# Altium schematic sheet MICROCONTROLLER.SchDoc
size 420 x 297 mm; SheetNumber: 2; SheetTotal: 3
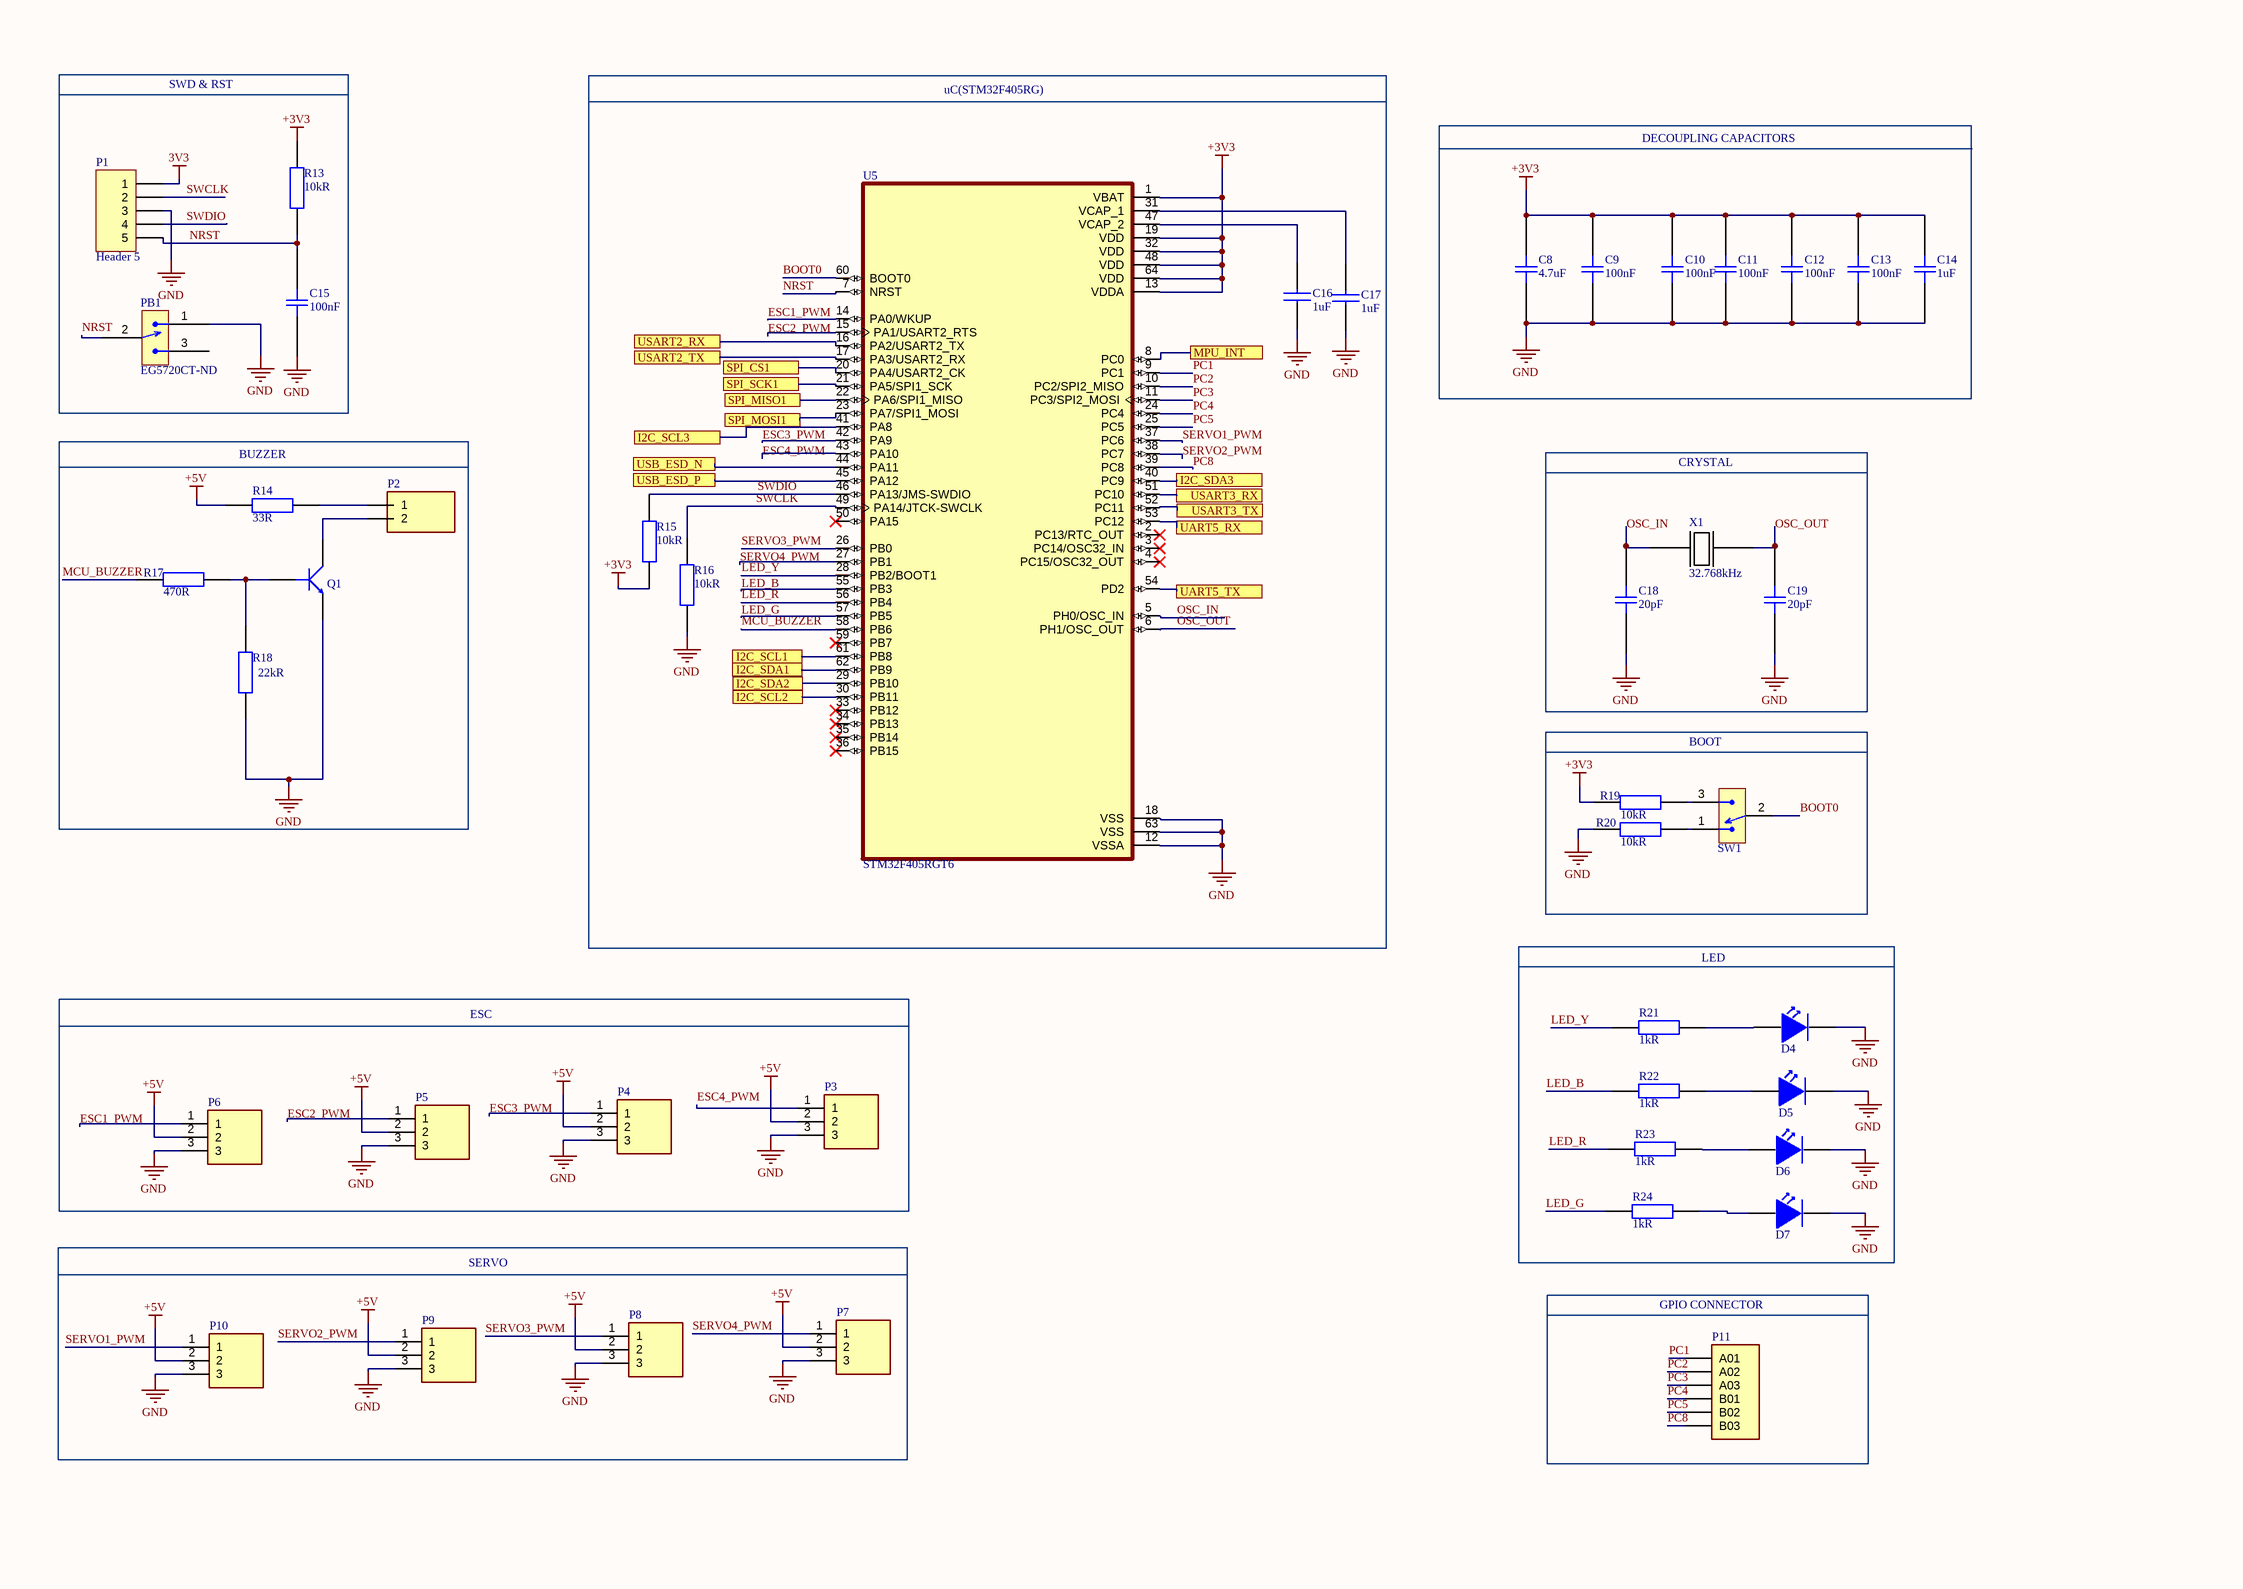
[diagram p0: MICROCONTROLLER.SchDoc]

## Parts
C8  Capacitance: 4.7uF  [CAP_0805]  (hidden comment: CL21A475KAQNNNE)
C9  Capacitance: 100nF  [CAP_0603]  (hidden comment: CAP CER 100nF 0603)
C10  Capacitance: 100nF  [CAP_0603]  (hidden comment: CAP CER 100nF 0603)
C11  Capacitance: 100nF  [CAP_0603]  (hidden comment: CAP CER 100nF 0603)
C12  Capacitance: 100nF  [CAP_0603]  (hidden comment: CAP CER 100nF 0603)
C13  Capacitance: 100nF  [CAP_0603]  (hidden comment: CAP CER 100nF 0603)
C14  Capacitance: 1uF  [CAP_0805]  (hidden comment: CAP_CER_1uF 0805)
C15  Capacitance: 100nF  [CAP_0603]  (hidden comment: CAP CER 100nF 0603)
C16  Capacitance: 1uF  [CAP_0805]  (hidden comment: CL21B105KBFNNNE)
C17  Capacitance: 1uF  [CAP_0805]  (hidden comment: CL21B105KBFNNNE)
C18  Parameter 1: 20pF  [CAP_0603]  (hidden comment: CAP_CER_20pF)
C19  Parameter 1: 20pF  [CAP_0603]  (hidden comment: CAP_CER_20pF)
D4  LED_GREEN_0805  [LED_GREEN_0805]  (value not drawn)
D5  LED_GREEN_0805  [LED_GREEN_0805]  (value not drawn)
D6  LED_GREEN_0805  [LED_GREEN_0805]  (value not drawn)
D7  LED_GREEN_0805  [LED_GREEN_0805]  (value not drawn)
P1  Header 5  [HDR1X5]
P2  Connector Header Through Hole  [S2B-XH-A]  (value not drawn)
P3  Header 3 pin  [5-146281-3 header]  (value not drawn)
P4  Header 3 pin  [5-146281-3 header]  (value not drawn)
P5  Header 3 pin  [5-146281-3 header]  (value not drawn)
P6  Header 3 pin  [5-146281-3 header]  (value not drawn)
P7  Header 3 pin  [5-146281-3 header]  (value not drawn)
P8  Header 3 pin  [5-146281-3 header]  (value not drawn)
P9  Header 3 pin  [5-146281-3 header]  (value not drawn)
P10  Header 3 pin  [5-146281-3 header]  (value not drawn)
P11  Connector 2x3 SMD  [AMPHENOL]  (value not drawn)
PB1  Supplier Part Number 1: EG5720CT-ND  [EG1215AA]  (hidden comment: EG1215AA)
Q1  BC817  [SOT95P23]  (value not drawn)
R13  Resistance: 10kR  [RES_0603]  (hidden comment: RC0603FR-0710KL)
R14  Resistance: 33R  [RES_0603]  (hidden comment: RC0603JR-0715RL)
R15  Resistance: 10kR  [RES_0603]  (hidden comment: RC0603FR-0710KL)
R16  Resistance: 10kR  [RES_0603]  (hidden comment: RC0603FR-0710KL)
R17  Resistance: 470R  [RES_0603]  (hidden comment: RC0603FR-0710KL)
R18  Resistance: 22kR  [RES_0603]  (hidden comment: RC0603FR-0710KL)
R19  Resistance: 10kR  [RES_0603]  (hidden comment: RC0603FR-0710KL)
R20  Resistance: 10kR  [RES_0603]  (hidden comment: RC0603FR-0710KL)
R21  Resistance: 1kR  [RES_0603]  (hidden comment: RC0603FR-0710KL)
R22  Resistance: 1kR  [RES_0603]  (hidden comment: RC0603FR-0710KL)
R23  Resistance: 1kR  [RES_0603]  (hidden comment: RC0603FR-0710KL)
R24  Resistance: 1kR  [RES_0603]  (hidden comment: RC0603FR-0710KL)
SW1  EG1215AA  [EG1215AA]  (value not drawn)
U5  STM32F405RGT6  [QFP50P_STM32]
X1  Frequency: 32.768kHz  [ABS05-32.768KHZ-T]  (hidden comment: CRYSTAL 32.768kHz)

## Blocks framed on the sheet
SWD & RST: C15 P1 PB1 R13
uC(STM32F405RG): C16 C17 R15 R16 U5
DECOUPLING CAPACITORS: C8-C14
BUZZER: P2 Q1 R14 R17 R18
CRYSTAL: C18 C19 X1
BOOT: R19 R20 SW1
LED: D4-D7 R21-R24
ESC: P3-P6
SERVO: P7-P10
GPIO CONNECTOR: P11

## Ports
I2C_SCL1 (see MODULES[2A]), I2C_SCL2 (see MODULES[4A]), I2C_SCL3 (see MODULES[5D]), I2C_SDA1 (see MODULES[2A]), I2C_SDA2 (see MODULES[4A]), I2C_SDA3 (see MODULES[5D]), MPU_INT (see MODULES[3A]), SPI_CS1 (see MODULES[1C]), SPI_MISO1 (see MODULES[2C]), SPI_MOSI1 (see MODULES[1C]), SPI_SCK1 (see MODULES[1C]), UART5_RX (see MODULES[4D]), UART5_TX (see MODULES[4D]), USART2_RX (see MODULES[4C]), USART2_TX (see MODULES[4C]), USART3_RX (see MODULES[5C]), USART3_TX (see MODULES[5C]), USB_ESD_N (see POWER[5A]), USB_ESD_P (see POWER[5A])

## Nets
3V3: P1.1
+3V3: C8.2 C9.2 C10.2 C11.2 C12.2 C13.2 C14.2 R13.2 R15.1 R19.1 U5.1(VBAT) U5.13(VDDA) U5.19(VDD) U5.32(VDD) U5.48(VDD) U5.64(VDD)
+5V: P3.2 P4.2 P5.2 P6.2 P7.2 P8.2 P9.2 P10.2 R14.1
GND: C8.1 C9.1 C10.1 C11.1 C12.1 C13.1 C14.1 C15.1 C16.1 C17.1 C18.1 C19.1 D4.1 D5.1 D6.1 D7.1 P1.3 P3.3 P4.3 P5.3 P6.3 P7.3 P8.3 P9.3 P10.3 PB1.1 Q1.2 R16.1 R18.1 R20.1 U5.12(VSSA) U5.18(VSS) U5.63(VSS)
BOOT0: SW1.2 U5.60(BOOT0)
ESC1_PWM: P6.1 U5.14(PA0/WKUP)
ESC2_PWM: P5.1 U5.15(PA1/USART2_RTS)
ESC3_PWM: P4.1 U5.42(PA9)
ESC4_PWM: P3.1 U5.43(PA10)
I2C_SCL1: U5.61(PB8) ; port I2C_SCL1
I2C_SCL2: U5.30(PB11) ; port I2C_SCL2
I2C_SCL3: U5.41(PA8) ; port I2C_SCL3
I2C_SDA1: U5.62(PB9) ; port I2C_SDA1
I2C_SDA2: U5.29(PB10) ; port I2C_SDA2
I2C_SDA3: U5.40(PC9) ; port I2C_SDA3
LED_B: R22.1 U5.55(PB3)
LED_G: R24.1 U5.57(PB5)
LED_R: R23.1 U5.56(PB4)
LED_Y: R21.1 U5.28(PB2/BOOT1)
MCU_BUZZER: R17.1 U5.58(PB6)
MPU_INT: U5.8(PC0) ; port MPU_INT
NRST: C15.2 P1.5 PB1.2 R13.1 U5.7(NRST)
OSC_IN: C18.2 U5.5(PH0/OSC_IN) X1.1
OSC_OUT: C19.2 U5.6(PH1/OSC_OUT) X1.2
PC1: P11.A01 U5.9(PC1)
PC2: P11.A02 U5.10(PC2/SPI2_MISO)
PC3: P11.A03 U5.11(PC3/SPI2_MOSI)
PC4: P11.B01 U5.24(PC4)
PC5: P11.B02 U5.25(PC5)
PC8: P11.B03 U5.39(PC8)
SERVO1_PWM: P10.1 U5.37(PC6)
SERVO2_PWM: P9.1 U5.38(PC7)
SERVO3_PWM: P8.1 U5.26(PB0)
SERVO4_PWM: P7.1 U5.27(PB1)
SPI_CS1: U5.20(PA4/USART2_CK) ; port SPI_CS1
SPI_MISO1: U5.22(PA6/SPI1_MISO) ; port SPI_MISO1
SPI_MOSI1: U5.23(PA7/SPI1_MOSI) ; port SPI_MOSI1
SPI_SCK1: U5.21(PA5/SPI1_SCK) ; port SPI_SCK1
SWCLK: P1.2 R16.2 U5.49(PA14/JTCK-SWCLK)
SWDIO: P1.4 R15.2 U5.46(PA13/JMS-SWDIO)
UART5_RX: U5.53(PC12) ; port UART5_RX
UART5_TX: U5.54(PD2) ; port UART5_TX
USART2_RX: U5.16(PA2/USART2_TX) ; port USART2_RX
USART2_TX: U5.17(PA3/USART2_RX) ; port USART2_TX
USART3_RX: U5.51(PC10) ; port USART3_RX
USART3_TX: U5.52(PC11) ; port USART3_TX
USB_ESD_N: U5.44(PA11) ; port USB_ESD_N
USB_ESD_P: U5.45(PA12) ; port USB_ESD_P
NetC16_2: C16.2 U5.47(VCAP_2)
NetC17_2: C17.2 U5.31(VCAP_1)
NetD4_2: D4.2 R21.2
NetD5_2: D5.2 R22.2
NetD6_2: D6.2 R23.2
NetD7_2: D7.2 R24.2
NetP2_1: P2.1 R14.2
NetP2_2: P2.2 Q1.3
NetQ1_1: Q1.1 R17.2 R18.2
NetR19_2: R19.2 SW1.3
NetR20_2: R20.2 SW1.1

Not connected (* = marked no-connect by the designer): PB1 3; U5 2(PC13/RTC_OUT)* 3(PC14/OSC32_IN)* 4(PC15/OSC32_OUT)* 33(PB12)* 34(PB13)* 35(PB14)* 36(PB15)* 50(PA15)* 59(PB7)*

## Notes on the sheet
- THIS DOCUMENT AND THE DATA DISCLOSED HEREIN OR
- HEREWITH IS THE PROPERTY OF ALTIUM LIMITED AND MAY
- DWG NO:
- REVISION
- REV:
- DESCRIPTION
- DATE
- APPROVED
- BE FREELY DISTRIBUTED IN WHOLE. NO RIGHTS ARE
- RESERVED OR EXPRESS OR IMPLIED WARANTEE GIVEN.
- ENG:
- APPROVALS
- PROJECT
- DSN:
- CHK:
- REFERENCE DOCUMENTS
- PROJECT REVISION:
- TITLE
- DOCUMENT REVISION:
- DESIGN ITEM:
- BOM:
- FAB DWG:
- PCB DWG:
- ASSY DWG:
- SCALE:
- A3
- SIZE
- CAGE CODE
- FILE NAME
- DWG NO.
- SHEET
- OF
- REV

## Library data of the parts
C8 = CAP CER 4.7uF 0805: Multilayer Ceramic Capacitor, 4.7 uF, 25 V, ± 10%, X5R, 0805 [2012 Metric]; Manufacturer: Samsung; Voltage Rating: 25V; Supplier 1: Digikey; Manufacturer Part Number: CL21A475KAQNNNE; RoHS: Yes; Category: Ceramic Capacitors; Stock 1: 3190611; Pricing 1: 1=0,1, 10=0,069, 50=0,0414, 100=0,0326, 500=0,02408, 1000=0,01994 (USD); Mount: Surface Mount; Case/Package: 0805; Case Code (Metric): 2012; Case Code (Imperial): 0805; Material: Ceramic; Min Operating Temperature: -55°C; Max Operating Temperature: 85°C; Packaging: Tape and Reel; Tolerance: 10%; Dielectric: X5R; Voltage Rating (DC): 25V; Series: CL; Construction: Flat; Length: 2mm; Height: 1.25mm; Depth: 1.25mm; Radiation Hardening: No; Lead Free: Lead Free; RoHS Compliant: Yes; ComponentLink1URL: https://datasheet.ciiva.com/25798/cl21a475kaqnnne-25798882.pdf?src-supplier=Digikey; ComponentLink1Description: https://datasheet.ciiva.com/25798/cl21a475kaqnnne-25798882.pdf?src-supplier=Digikey; Supplier Part Number 1: 1276-1244-1-ND
C9-C13 C15 = CAP CER 100nF 0603: Multilayer Ceramic Capacitor, 0.1 uF, 50 V, ± 10%, X7R, 0603 [1608 Metric]; Manufacturer: KEMET; Manufacturer Part Number: C0603C104K5RACTU; Material: 4241ConductorMaterial; Voltage Rating: 50V; Temperature Coefficient: 30ppm/°C; Supplier 1: Digikey; RoHS: Yes; Category: Ceramic Capacitors; Stock 1: 4814912; Pricing 1: 1=0,11, 10=0,074, 50=0,0424, 100=0,0329, 500=0,02474, 1000=0,01944 (USD); Mount: Surface Mount; Case/Package: 0603; Min Operating Temperature: -55°C; Max Operating Temperature: 125°C; Tolerance: 10%; Packaging: Tape and Reel; Dielectric: X7R; Voltage: 50V; Series: SMD Comm X7R; Length: 0.063inch; Width: 0.031inch; Thickness: 0.034inch; RoHS Compliant: Yes; Lead Free: 5697LeadFree; Supplier Part Number 1: 399-C0603C104K5RAC7867DKR-ND
C14 = CAP_CER_1uF 0805: Multilayer Ceramic Capacitor, 1 uF, 25 V, ± 10%, X7R, 0805 [2012 Metric]; Manufacturer: Kyocera AVX; Manufacturer Part Number: 08053C105K4T2A; Material: 4241ConductorMaterial; Voltage Rating: 25V; Dissipation Factor: 12.5%; Insulation Resistance: 100GR; Supplier 1: Digikey; RoHS: Yes; Category: Ceramic Capacitors; Stock 1: 50944; Pricing 1: 1=0,32, 10=0,207, 50=0,145, 100=0,1171, 500=0,08702, 1000=0,07614 (USD); Mount: Surface Mount; Case/Package: 0805; Case Code (Imperial): 0805; Case Code (Metric): 2012; Min Operating Temperature: -55°C; Max Operating Temperature: 125°C; Tolerance: 10%; Packaging: Tape and Reel; Dielectric: X7R; Series: -; Voltage Rating (DC): 25V; Package Quantity: 1; Termination: SMD/SMT; Construction: Flat; Length: 2.01mm; Width: 0.049inch; Height: 1.4mm; Thickness: 0.037inch; Depth: 1.25mm; Ratings: AEC-Q200; Radiation Hardening: No; RoHS Compliant: Yes; Lead Free: Lead Free; Reach SVHC Compliant: No; ComponentLink1URL: https://datasheet.ciiva.com/11499/cauto-11499837.pdf?src-supplier=Avnet; ComponentLink1Description: https://datasheet.ciiva.com/11499/cauto-11499837.pdf?src-supplier=Avnet; ComponentLink2URL: https://datasheet.ciiva.com/22682/1679506-22682869.pdf?src-supplier=Element14; ComponentLink2Description: https://datasheet.ciiva.com/22682/1679506-22682869.pdf?src-supplier=Element14; ComponentLink3URL: https://datasheet.ciiva.com/28586/1679506-28586101.pdf?src-supplier=Element14; ComponentLink3Description: https://datasheet.ciiva.com/28586/1679506-28586101.pdf?src-supplier=Element14; ComponentLink4URL: https://datasheet.ciiva.com/28586/1679506-28586778.pdf?src-supplier=Element14; ComponentLink4Description: https://datasheet.ciiva.com/28586/1679506-28586778.pdf?src-supplier=Element14; ComponentLink5URL: https://datasheet.ciiva.com/154/cauto-154795.pdf?src-supplier=Digikey; ComponentLink5Description: https://datasheet.ciiva.com/154/cauto-154795.pdf?src-supplier=Digikey; ComponentLink6URL: https://datasheet.ciiva.com/154/cauto-154794.pdf?src-supplier=Digikey; ComponentLink6Description: https://datasheet.ciiva.com/154/cauto-154794.pdf?src-supplier=Digikey; ComponentLink7URL: https://datasheet.ciiva.com/154/cauto-154796.pdf?src-supplier=Digikey; ComponentLink7Description: https://datasheet.ciiva.com/154/cauto-154796.pdf?src-supplier=Digikey; ComponentLink8URL: https://datasheet.ciiva.com/5412/cauto-5412822.pdf?src-supplier=Mouser; ComponentLink8Description: https://datasheet.ciiva.com/5412/cauto-5412822.pdf?src-supplier=Mouser; Supplier Part Number 1: 478-KAM21KR71E105KUCT-ND
C16 C17 = CAP CER 1uF 0805: CAP CER 1uF %10 0805; Manufacturer: Samsung; Designed by: BERK; Tolerance: 10%; Voltage Rating: 50V; Dielectric: X7R; Supplier 1: Digi-Key; Manufacturer Part Number: CL21B105KBFNNNE; RoHS: Yes; Category: Ceramic Capacitors; Stock 1: 958000; Pricing 1: 2000=0,02138, 4000=0,01956 (USD); Mount: Surface Mount; Case/Package: 0805; Case Code (Metric): 2012; Case Code (Imperial): 0805; Min Operating Temperature: -55°C; Max Operating Temperature: 125°C; Packaging: Tape and Reel; Package Quantity: 1; Voltage: 50V; Series: CL; Construction: Flat; Length: 2mm; Width: 0.049inch; Height: 1.25mm; Thickness: 0.053inch; Depth: 1.25mm; Radiation Hardening: No; RoHS Compliant: Yes; ComponentLink1URL: https://datasheet.ciiva.com/25800/cl21b105kbfnnne-25800291.pdf?src-supplier=Digi-Key; ComponentLink1Description: https://datasheet.ciiva.com/25800/cl21b105kbfnnne-25800291.pdf?src-supplier=Digi-Key; ComponentLink2URL: https://datasheet.ciiva.com/16449/cl21b105kbfnnne-16449003.pdf?src-supplier=Future+Electronics; ComponentLink2Description: https://datasheet.ciiva.com/16449/cl21b105kbfnnne-16449003.pdf?src-supplier=Future+Electronics; ComponentLink3URL: https://datasheet.ciiva.com/26838/getdatasheetpartid-354075-26838668.pdf?src-supplier=Verical; ComponentLink3Description: https://datasheet.ciiva.com/26838/getdatasheetpartid-354075-26838668.pdf?src-supplier=Verical; Supplier Part Number 1: 1276-1029-2-ND
C18 C19 = CAP_CER_20pF: Multilayer Ceramic Capacitor, 20 pF, 50 V, ± 5%, C0G (NP0), 0603 [1608 Metric]; Manufacturer: Samsung; Manufacturer Part Number: CL10C200JB8NNNC; Voltage Rating (DC): 50V; Supplier 1: Digikey; RoHS: Yes; Category: Ceramic Capacitors; Stock 1: 288914; Pricing 1: 1=0,1, 10=0,041, 50=0,0238, 100=0,0184, 500=0,01386, 1000=0,01089 (USD); ComponentLink1URL: https://datasheet.ciiva.com/26877/getdatasheetpartid-640634-26877974.pdf?src-supplier=Verical; ComponentLink1Description: https://datasheet.ciiva.com/26877/getdatasheetpartid-640634-26877974.pdf?src-supplier=Verical; ComponentLink2URL: https://datasheet.ciiva.com/26310/mlcc-catalogdownload2013-eng-26310315.pdf?src-supplier=Distrelec; ComponentLink2Description: https://datasheet.ciiva.com/26310/mlcc-catalogdownload2013-eng-26310315.pdf?src-supplier=Distrelec; Supplier Part Number 1: 1276-1187-1-ND
D4-D7 = LED_GREEN_0805: LED Low-Power Uni-Color Green 565nm 2.1V 2-Pin Chip LED T/R; Manufacturer: Vishay Lite-On; Manufacturer Part Number: LTST-C171GKT; Lens Color: Colorless; Viewing Angle: 130°; Lens Style: Flat,Diffused,Colorless,Rectangular,Clear; Luminous Intensity: 12mcd; Forward Current: 30mA; Power Rating: 100mW; Dominant Wavelength: 569nm; Test Current: 10mA; Lens Transparency: Clear; Number of Elements: 1; Reverse Voltage: 5V; Lens Size: 1.25mm; Supplier 1: Digikey; RoHS: Yes; Category: LEDs; Stock 1: 370169; Pricing 1: 1=0,26, 10=0,143, 100=0,0663, 500=0,0612, 1000=0,04794 (USD); Mount: Surface Mount; Case/Package: 0805; Number of Pins: 2; Color: Green; Case Code (Metric): 2012; Case Code (Imperial): 0805; Min Operating Temperature: -55°C; Max Operating Temperature: 85°C; Package Quantity: 3000; Packaging: Tape and Reel; Forward Voltage: 2.1V; Illumination Color: Green; Power Dissipation: 100mW; Wavelength: 565nm; Number of LEDs: 1; Series: -; Length: 2mm; Width: 1.25mm; Height: 0.9mm; Depth: 1.25mm; Radiation Hardening: No; Lead Free: Lead Free; RoHS Compliant: Yes; ComponentLink1URL: https://datasheet.ciiva.com/2110/ltst-c171gkt-2110000.pdf?src-supplier=Digikey; ComponentLink1Description: https://datasheet.ciiva.com/2110/ltst-c171gkt-2110000.pdf?src-supplier=Digikey; ComponentLink2URL: https://datasheet.ciiva.com/11773/0900766b80dc0296-11773991.pdf?src-supplier=Rs; ComponentLink2Description: https://datasheet.ciiva.com/11773/0900766b80dc0296-11773991.pdf?src-supplier=Rs; ComponentLink3URL: https://datasheet.ciiva.com/12400/lite-on-ltst-c171gkt-190133-12400647.pdf?src-supplier=Mouser; ComponentLink3Description: https://datasheet.ciiva.com/12400/lite-on-ltst-c171gkt-190133-12400647.pdf?src-supplier=Mouser; ComponentLink4URL: https://datasheet.ciiva.com/2110/ltst-c171gkt-2110001.pdf?src-supplier=Digikey; ComponentLink4Description: https://datasheet.ciiva.com/2110/ltst-c171gkt-2110001.pdf?src-supplier=Digikey; ComponentLink5URL: https://datasheet.ciiva.com/2110/ltst-c171gkt-2110002.pdf?src-supplier=Digikey; ComponentLink5Description: https://datasheet.ciiva.com/2110/ltst-c171gkt-2110002.pdf?src-supplier=Digikey; ComponentLink6URL: https://datasheet.ciiva.com/16396/ltst-c171gkt-16396549.pdf?src-supplier=Future+Electronics; ComponentLink6Description: https://datasheet.ciiva.com/16396/ltst-c171gkt-16396549.pdf?src-supplier=Future+Electronics; Supplier Part Number 1: 160-1423-6-ND
P1 = Header 5: Header, 5-Pin; LatestRevisionDate: 17-Jul-2002; LatestRevisionNote: Re-released for DXP Platform.; Publisher: Altium Limited
P3-P10 = Header 3 pin: CONN HEADER VERT 3POS 2.54MM / Connector Header Through Hole 3 position 0.100" (2.54mm); Manufacturer: TE Connectivity; Manufacturer Part Number: 5-146281-3; Manufacturer Lifecycle Status: ACTIVE; Approvals: CSA; Connector Type: Header, Pin, Plug; Contact Current Rating: 3A; Gender: Male; High Speed Serial Data Connector: No; High Temperature Housing: Yes; Insulation Resistance: 5GΩ; Lead Length: 3.048mm; Mating Post Length: 5.842mm; Number of Contacts: 3; Number of Ports: 1; PCB Mounting Orientation: Vertical; PCB Thickness: 1.6002mm; Plating Thickness: 762nm; Shielding: Unshielded; Supplier 1: Farnell; RoHS: Compliant; Category: Headers and Wire Housings; Stock 1: 263; Pricing 1: 10=0,602, 50=0,55, 100=0,462, 250=0,419 (EUR); China RoHS: Compliant; Color: Black; Contact Gender: Male; Contact Mating Length: 5.842mm; Contact Plating: Gold; Contact Shape: Square; Contact Style: Pin; Current Rating: 3A; Depth: 2.34mm; Export Control Classification Number (ECCN) Code: EAR99; ELV: Compliant; Flammability Rating: UL94 V-0; Housing Color: Black; Housing Material: Polymer; Harmonized Tariff Schedule (HTS) Code: 8536.69.40.40; Insulation Color: Black; Introduction Date: 2005-06-13; Keyed: No; Lead Free: Lead Free; Length: 7.21mm; Lifecycle Status: Production; Max Operating Temperature: 105°C; Min Operating Temperature: -65°C; Mount: Through Hole; Number of Pins: 3; Number of Positions: 3; Number of Rows: 1; Orientation: Vertical; Packaging: Carton; Pitch: 2.54mm; Radiation Hardening: No; Ratings: CSA; REACH SVHC: Yes; Row Spacing: 2.54mm; Terminal Pitch: 2.54mm; Termination: Solder; ComponentLink1URL: https://datasheet.octopart.com:443/5-146281-3-TE-Connectivity-datasheet-180097156.pdf?src-supplier=JRH+Electronics; ComponentLink1Description: https://datasheet.octopart.com:443/5-146281-3-TE-Connectivity-datasheet-180097156.pdf?src-supplier=JRH+Electronics; ComponentLink2URL: https://datasheet.octopart.com:443/5-146281-3-TE-Connectivity-datasheet-181434920.pdf?src-supplier=JRH+Electronics; ComponentLink2Description: https://datasheet.octopart.com:443/5-146281-3-TE-Connectivity-datasheet-181434920.pdf?src-supplier=JRH+Electronics; ComponentLink3URL: https://datasheet.octopart.com:443/5-146281-3-TE-Connectivity-datasheet-11894384.pdf?src-supplier=Electro+Sonic; ComponentLink3Description: https://datasheet.octopart.com:443/5-146281-3-TE-Connectivity-datasheet-11894384.pdf?src-supplier=Electro+Sonic; ComponentLink4URL: https://sigma.octopart.com:443/136685837/technical_drawing/TE-Connectivity-5-146281-3.pdf?src-supplier=Sager+Electronics; ComponentLink4Description: https://sigma.octopart.com:443/136685837/technical_drawing/TE-Connectivity-5-146281-3.pdf?src-supplier=Sager+Electronics; ComponentLink5URL: https://sigma.octopart.com:443/77883388/technical_drawing/TE-Connectivity-5-146281-3.pdf?src-supplier=TE+Connectivity; ComponentLink5Description: https://sigma.octopart.com:443/77883388/technical_drawing/TE-Connectivity-5-146281-3.pdf?src-supplier=TE+Connectivity; ComponentLink6URL: https://datasheet.octopart.com:443/5-146281-3-AMP-datasheet-176948369.pdf?src-supplier=Burklin+Elektronik; ComponentLink6Description: https://datasheet.octopart.com:443/5-146281-3-AMP-datasheet-176948369.pdf?src-supplier=Burklin+Elektronik; ComponentLink7URL: https://datasheet.octopart.com:443/5-146281-3-TE-Connectivity-datasheet-62113853.pdf?src-supplier=RS+(Formerly+Allied+Electronics); ComponentLink7Description: https://datasheet.octopart.com:443/5-146281-3-TE-Connectivity-datasheet-62113853.pdf?src-supplier=RS+(Formerly+Allied+Electronics); ComponentLink8URL: https://datasheet.octopart.com:443/5-146281-3-TE-Connectivity-datasheet-20738154.pdf?src-supplier=RS+(Formerly+Allied+Electronics); ComponentLink8Description: https://datasheet.octopart.com:443/5-146281-3-TE-Connectivity-datasheet-20738154.pdf?src-supplier=RS+(Formerly+Allied+Electronics); ComponentLink9URL: https://datasheet.octopart.com:443/5-146281-3-Tyco-Electronics-datasheet-9871387.pdf?src-supplier=RS+(Formerly+Allied+Electronics); ComponentLink9Description: https://datasheet.octopart.com:443/5-146281-3-Tyco-Electronics-datasheet-9871387.pdf?src-supplier=RS+(Formerly+Allied+Electronics); ComponentLink10URL: http://sigma.octopart.com:80/38847167/materials_sheet/TE-Connectivity-5-146281-3.pdf?src-supplier=Compliance+Statements; ComponentLink10Description: http://sigma.octopart.com:80/38847167/materials_sheet/TE-Connectivity-5-146281-3.pdf?src-supplier=Compliance+Statements; ComponentLink11URL: http://sigma.octopart.com:80/78323269/materials_sheet/TE-Connectivity-5-146281-3.pdf?src-supplier=Compliance+Statements; ComponentLink11Description: http://sigma.octopart.com:80/78323269/materials_sheet/TE-Connectivity-5-146281-3.pdf?src-supplier=Compliance+Statements; ComponentLink12URL: http://sigma.octopart.com:80/136743184/materials_sheet/TE-Connectivity-5-146281-3.pdf?src-supplier=Compliance+Statements; ComponentLink12Description: http://sigma.octopart.com:80/136743184/materials_sheet/TE-Connectivity-5-146281-3.pdf?src-supplier=Compliance+Statements; ComponentLink13URL: http://sigma.octopart.com:80/14915290/rohs_certificate/Agastat-5-146281-3.pdf?src-supplier=Compliance+Statements; ComponentLink13Description: http://sigma.octopart.com:80/14915290/rohs_certificate/Agastat-5-146281-3.pdf?src-supplier=Compliance+Statements; Supplier Part Number 1: 5-146281-3
P11 = Connector 2x3 SMD: 6pin 2.54mm 2 2.54mm Header，Push-Pull 3A 2.54μm tin SMD mount 7.78mm(Length)*7.37mm(height); Manufacturer: Amphenol Communications Solutions; Manufacturer Part Number: 10125394-T0803ALF; Dielectric Material: Polyethylene; Gender: Male; Insulation Resistance: 5GΩ; Number of Positions: 6; Row Spacing: 5.46mm; Supplier 1: Mouser; RoHS: Compliant; Category: Card Edge Connectors; Stock 1: 1906; Pricing 1: 1=0,55, 10=0,47, 50=0,47, 100=0,383, 1000=0,325, 10000=0,305 (USD); Current Rating: 3A; Insulation Color: Black; Lifecycle Status: Production; Max Operating Temperature: 125°C; Min Operating Temperature: -65°C; Number of Rows: 2; Orientation: Straight; Pitch: 2.54mm; Plating Thickness: 2.54µm; REACH SVHC: Yes; Terminal Pitch: 2.54mm; ComponentLink1URL: https://datasheet.octopart.com:443/10125394-T0803ALF-Amphenol-Communications-Solutions-datasheet-182239538.pdf?src-supplier=IHS; ComponentLink1Description: https://datasheet.octopart.com:443/10125394-T0803ALF-Amphenol-Communications-Solutions-datasheet-182239538.pdf?src-supplier=IHS; Supplier Part Number 1: 649-10125394T0803ALF
PB1 = EG1215AA: Slide Switch, SPDT, 0.025A, 24V, SMD; Manufacturer: E-Switch; Mechanical Life: 10000Cycles; Switch Function: On-On; Actuator Type: Standard; Switch Travel: 1.5mm; Operating Force: 150gf; Actuator Length: 1.4mm; Supplier 1: Digikey; Manufacturer Part Number: EG1215AA; RoHS: Yes; Stock 1: 15837; Pricing 1: 1=0,99, 10=0,951, 25=0,8884, 100=0,7715, 250=0,702, 500=0,6508, 1000=0,60327 (USD); Mount: Surface Mount; Min Operating Temperature: -20°C; Max Operating Temperature: 70°C; Throw Configuration: SPDT; Packaging: Cut Tape; Voltage Rating (DC): 24V; Termination: Gull Wing; Electrical Life: 10000Cycles; Series: EG; RoHS Compliant: Yes; ComponentLink1URL: https://media.digikey.com/pdf/Data%20Sheets/E-Switch%20PDFs/EG1215_Series_Ds.pdf?src-supplier=Digikey; ComponentLink1Description: https://media.digikey.com/pdf/Data%20Sheets/E-Switch%20PDFs/EG1215_Series_Ds.pdf?src-supplier=Digikey; ComponentLink2URL: http://www.farnell.com/datasheets/2645007.pdf?src-supplier=Farnell; ComponentLink2Description: http://www.farnell.com/datasheets/2645007.pdf?src-supplier=Farnell
R13 R15-R20 = RES 10K OHM 0603: RES 10K %1 OHM 0603 SMD; Manufacturer: Yageo; Designed by: BERK; Tolerance: 1%; Temperature Coefficient: 100ppm/°C; Voltage Rating (DC): 50V; Power Rating: 100mW; Voltage Rating: 75V; Supplier 1: Digi-Key; Manufacturer Part Number: RC0603FR-0710KL; RoHS: Yes; Category: Chip SMD Resistors; Stock 1: 24140601; Pricing 1: 1=0,10000, 10=0,02300, 100=0,00930, 1000=0,00417, 2500=0,00362 (USD); Case/Package: 0603; Number of Pins: 2; Case Code (Imperial): 0603; Case Code (Metric): 1608; Weight: 7.1E-05oz; Size Code: 0603; Min Operating Temperature: -55°C; Max Operating Temperature: 155°C; Resistor Type: Thick Film; Packaging: Tape and Reel; Termination: SMD/SMT; Features: Moisture Resistant; Series: RC; Max Power Dissipation: 100mW; Number of Terminations: 2; Resistance Tolerance: 1%; Construction: Rectangular; Length: 1.6mm; Width: 0.8mm; Height: 0.45mm; Depth: 0.8mm; Lead Pitch: 0.3mm; REACH SVHC: Unknown; Lead Free: Lead Free; Military Standard: Not; RoHS Compliant: Yes; ComponentLink1URL: https://datasheet.ciiva.com/7660/38590-7660789.pdf?src-supplier=Element14; ComponentLink1Description: https://datasheet.ciiva.com/7660/38590-7660789.pdf?src-supplier=Element14; ComponentLink2URL: https://datasheet.ciiva.com/15189/getdatasheetpartid-409289-15189591.pdf?src-supplier=Verical; ComponentLink2Description: https://datasheet.ciiva.com/15189/getdatasheetpartid-409289-15189591.pdf?src-supplier=Verical; ComponentLink3URL: https://datasheet.ciiva.com/46440/1868787-46440891.pdf?src-supplier=Element14; ComponentLink3Description: https://datasheet.ciiva.com/46440/1868787-46440891.pdf?src-supplier=Element14; ComponentLink4URL: https://datasheet.ciiva.com/7983/443971-7983596.pdf?src-supplier=Element14; ComponentLink4Description: https://datasheet.ciiva.com/7983/443971-7983596.pdf?src-supplier=Element14; ComponentLink5URL: https://datasheet.ciiva.com/7746/1738695-7746239.pdf?src-supplier=Element14; ComponentLink5Description: https://datasheet.ciiva.com/7746/1738695-7746239.pdf?src-supplier=Element14; ComponentLink6URL: https://datasheet.ciiva.com/22747/443971-22747519.pdf?src-supplier=Element14; ComponentLink6Description: https://datasheet.ciiva.com/22747/443971-22747519.pdf?src-supplier=Element14; Supplier Part Number 1: 311-10.0KHRCT-ND
R14 = RES 15 OHM 0603: RES 15 %5 OHM 0603 SMD; Manufacturer: Yageo; Tolerance: 5%; Temperature Coefficient: 100ppm/°C; Voltage Rating (DC): 50V; Power Rating: 100mW; Voltage Rating: 75V; Designed by: BERK; Supplier 1: Digi-Key; Manufacturer Part Number: RC0603JR-0715RL; RoHS: Yes; Category: Chip SMD Resistors; Stock 1: 1720; Pricing 1: 1=0,10000, 10=0,01900, 100=0,00770, 1000=0,00344, 2500=0,00298 (USD); Case/Package: 0603; Number of Pins: 2; Case Code (Imperial): 0603; Case Code (Metric): 1608; Weight: 7.1E-05oz; Min Operating Temperature: -55°C; Max Operating Temperature: 155°C; Resistor Type: Thick Film; Packaging: Tape and Reel; Package Quantity: 1; Termination: SMD/SMT; Number of Terminations: 2; Max Power Dissipation: 100mW; Working Voltage: 75V; Features: Moisture Resistant; Series: RC; Resistance Tolerance: 5%; Construction: Rectangular; Length: 1.6mm; Width: 0.8mm; Height: 0.022inch; Depth: 0.8mm; REACH SVHC: No SVHC; Lead Free: Lead Free; Military Standard: Not; RoHS Compliant: Yes; ComponentLink1URL: https://datasheet.ciiva.com/2453/pyu-r-int-thick-7-2453085.pdf?src-supplier=Digi-Key; ComponentLink1Description: https://datasheet.ciiva.com/2453/pyu-r-int-thick-7-2453085.pdf?src-supplier=Digi-Key; ComponentLink2URL: https://datasheet.ciiva.com/7746/443971-7746445.pdf?src-supplier=Element14; ComponentLink2Description: https://datasheet.ciiva.com/7746/443971-7746445.pdf?src-supplier=Element14; ComponentLink3URL: https://datasheet.ciiva.com/2453/pyu-r-int-thick-7-2453086.pdf?src-supplier=Digi-Key; ComponentLink3Description: https://datasheet.ciiva.com/2453/pyu-r-int-thick-7-2453086.pdf?src-supplier=Digi-Key; ComponentLink4URL: https://datasheet.ciiva.com/7746/443971-7746446.pdf?src-supplier=Element14; ComponentLink4Description: https://datasheet.ciiva.com/7746/443971-7746446.pdf?src-supplier=Element14; ComponentLink5URL: https://datasheet.ciiva.com/2453/pyu-r-int-thick-7-2453087.pdf?src-supplier=Digi-Key; ComponentLink5Description: https://datasheet.ciiva.com/2453/pyu-r-int-thick-7-2453087.pdf?src-supplier=Digi-Key; Supplier Part Number 1: 311-15GRCT-ND
R21-R24 = RES 1K OHM 0603: RES 1K %1 OHM 0603 SMD; Manufacturer: Yageo; Manufacturer Part Number: RC0603JR-071KL; Designed by: BERK; Tolerance: 5%; Temperature Coefficient: 100ppm/°C; Voltage Rating (DC): 50V; Power Rating: 100mW; Body Length: 1.6mm; Supplier 1: Digi-Key; RoHS: Yes; Category: Chip SMD Resistors; Stock 1: 5112056; Pricing 1: 1=0,10000, 10=0,01900, 100=0,00770, 1000=0,00344, 2500=0,00298 (USD); Case/Package: 0603; Number of Pins: 2; Contact Plating: Tin,Matte; Case Code (Imperial): 0603; Case Code (Metric): 1608; Size Code: 0603; Min Operating Temperature: -55°C; Max Operating Temperature: 155°C; Resistor Type: Thick Film; Packaging: Tape and Reel; Package Quantity: 5000; Voltage Rating: 50V; Termination: SMD/SMT; Series: RC; Resistance Tolerance: 5%; Construction: Rectangular; Length: 1.6mm; Width: 0.8mm; Height: 0.45mm; Depth: 0.8mm; Radiation Hardening: No; REACH SVHC: Unknown; Lead Free: Lead Free; Military Standard: Not; RoHS Compliant: Yes; ComponentLink1URL: https://datasheet.ciiva.com/8883/pyu-rc0603-51-rohs-l-4-8883051.pdf?src-supplier=Avnet; ComponentLink1Description: https://datasheet.ciiva.com/8883/pyu-rc0603-51-rohs-l-4-8883051.pdf?src-supplier=Avnet; ComponentLink2URL: https://datasheet.ciiva.com/7746/443971-7746461.pdf?src-supplier=Element14; ComponentLink2Description: https://datasheet.ciiva.com/7746/443971-7746461.pdf?src-supplier=Element14; ComponentLink3URL: https://datasheet.ciiva.com/22747/443971-22747533.pdf?src-supplier=Element14; ComponentLink3Description: https://datasheet.ciiva.com/22747/443971-22747533.pdf?src-supplier=Element14; ComponentLink4URL: https://datasheet.ciiva.com/7746/443971-7746462.pdf?src-supplier=Element14; ComponentLink4Description: https://datasheet.ciiva.com/7746/443971-7746462.pdf?src-supplier=Element14; Supplier Part Number 1: 311-1.0KGRCT-ND
SW1 = EG1215AA: Slide Switch, SPDT, 0.025A, 24V, SMD; Manufacturer: E-Switch; Designed by: BERK; Mechanical Life: 10000Cycles; Switch Function: On-On; Current Rating: 25mA; Actuator Type: Standard; Switch Travel: 1.5mm; Operating Force: 150gf; Zener Voltage: 9.1V; Tolerance: 4.95%; Max Power Dissipation: 5W; Impedance: 2R; Actuator Length: 1.4mm; Supplier 1: Digi-Key; Manufacturer Part Number: EG1215AA; RoHS: No; Stock 1: 6245; Pricing 1: 1=0,85000, 10=0,81900, 25=0,76560, 100=0,66470, 250=0,60480, 500=0,56070, 1000=0,51975 (USD); Mount: Surface Mount,Through Hole; Case/Package: Axial; Min Operating Temperature: -20°C; Max Operating Temperature: 175°C; Throw Configuration: SPDT; Packaging: Cut Tape; Voltage Rating (DC): 24V; Termination: Gull Wing; Electrical Life: 10000Cycles; ComponentLink1URL: https://media.digikey.com/pdf/Data%20Sheets/E-Switch%20PDFs/EG1215_Series_Ds.pdf?src-supplier=Digi-Key; ComponentLink1Description: https://media.digikey.com/pdf/Data%20Sheets/E-Switch%20PDFs/EG1215_Series_Ds.pdf?src-supplier=Digi-Key; ComponentLink2URL: http://www.farnell.com/datasheets/2645007.pdf?src-supplier=Farnell; ComponentLink2Description: http://www.farnell.com/datasheets/2645007.pdf?src-supplier=Farnell; Supplier Part Number 1: EG5720CT-ND
U5 = STM32F405RGT6: MCU 32-bit STM32F ARM Cortex M4F RISC 1024KB Flash 2.5V/3.3V 64-Pin LQFP Tray; Manufacturer: STMicroelectronics; ADC Channels (Resolution): 16-Ch 12-Bit; Core Architecture: ARM Cortex-M4; DAC Channels (Resolution): 2-Ch 12-Bit; Data Bus Width: 32b; EEPROM Memory Size: 0B; Flash Memory Size: 1MB; Frequency: 168MHz; Interface: CAN, I2C, I2S, IrDA, SPI, UART, USART, USB; Max Junction Temperature (Tj): 105°C; Max Supply Current: 109mA; Max Supply Voltage: 3.6V; Min Supply Voltage: 1.8V; Nominal Supply Current: 1.7µA; Nominal Supply Voltage (DC): 3.3V; Number of A/D Converters: 3; Number of ADC Channels: 16; Number of D/A Converters: 2; Number of I/Os: 8; Number of Programmable I/O: 51; Number of Timers/Counters: 15; Number of USART Channels: 4; Oscillator Type: Internal; Peripherals: POR, RTC; RAM Size: 196kB; Watchdog Timer: Yes; Supplier 1: Future Electronics; Manufacturer Part Number: STM32F405RGT6; RoHS: Compliant; Category: Microcontrollers; Stock 1: 1120; Pricing 1: 160=5,69, 320=5,66, 480=5,65, 640=5,64, 800=5,6 (USD); Ambient Temperature Range High: 85°C; Case/Package: LFQFP; China RoHS: Compliant; Country of Origin: Mainland China, Malaysia, Taiwan; Export Control Classification Number (ECCN) Code: 3A991.A.2; Height: 1.6mm; Height - Seated (Max): 1.6mm; Harmonized Tariff Schedule (HTS) Code: 8542.31.00.25; Introduction Date: 2013-06-04; Lead Free: Lead Free; Length: 10mm; Lifecycle Status: Production; Max Frequency: 168MHz; Max Operating Temperature: 85°C; Memory Size: 1MB; Memory Type: FLASH; Min Operating Temperature: -40°C; Number of Channels: 16; Number of I2C Channels: 3; Number of Interrupts: 16; Number of Pins: 64; Number of PWM Channels: 2; Number of SPI Channels: 3; Number of Terminals: 64; Number of UART Channels: 2; Number of USB Channels: 2; Radiation Hardening: No; REACH SVHC: Yes; Schedule B: 8542310000, 8542310000|8542310000|8542310000|8542310000|8542310000; Temperature Grade: Industrial; Terminal Pitch: 500µm; Width: 10mm; ComponentLink1URL: https://datasheet.octopart.com:443/STM32F405RGT6-STMicroelectronics-datasheet-181247466.pdf?src-supplier=IHS; ComponentLink1Description: https://datasheet.octopart.com:443/STM32F405RGT6-STMicroelectronics-datasheet-181247466.pdf?src-supplier=IHS; ComponentLink2URL: https://datasheet.octopart.com:443/STM32F405RGT6-STMicroelectronics-datasheet-12357803.pdf?src-supplier=Upverter; ComponentLink2Description: https://datasheet.octopart.com:443/STM32F405RGT6-STMicroelectronics-datasheet-12357803.pdf?src-supplier=Upverter; ComponentLink3URL: https://datasheet.octopart.com:443/STM32F405RGT6-STMicroelectronics-datasheet-10836202.pdf?src-supplier=Upverter; ComponentLink3Description: https://datasheet.octopart.com:443/STM32F405RGT6-STMicroelectronics-datasheet-10836202.pdf?src-supplier=Upverter; ComponentLink4URL: https://datasheet.octopart.com:443/STM32F405RGT6-STMicroelectronics-datasheet-68300831.pdf?src-supplier=ODG+(Origin+Data+Global); ComponentLink4Description: https://datasheet.octopart.com:443/STM32F405RGT6-STMicroelectronics-datasheet-68300831.pdf?src-supplier=ODG+(Origin+Data+Global); ComponentLink5URL: https://datasheet.octopart.com:443/STM32F405RGT6-STMicroelectronics-datasheet-62336716.pdf?src-supplier=STMicroelectronics; ComponentLink5Description: https://datasheet.octopart.com:443/STM32F405RGT6-STMicroelectronics-datasheet-62336716.pdf?src-supplier=STMicroelectronics; ComponentLink6URL: https://datasheet.octopart.com:443/STM32F405RGT6-STMicroelectronics-datasheet-159624841.pdf?src-supplier=Burklin+Elektronik; ComponentLink6Description: https://datasheet.octopart.com:443/STM32F405RGT6-STMicroelectronics-datasheet-159624841.pdf?src-supplier=Burklin+Elektronik; ComponentLink7URL: https://datasheet.octopart.com:443/STM32F405RGT6-STMicroelectronics-datasheet-41340394.pdf?src-supplier=TME; ComponentLink7Description: https://datasheet.octopart.com:443/STM32F405RGT6-STMicroelectronics-datasheet-41340394.pdf?src-supplier=TME; ComponentLink8URL: https://datasheet.octopart.com:443/STM32F405RGT6-STMicroelectronics-datasheet-16486449.pdf?src-supplier=Newark; ComponentLink8Description: https://datasheet.octopart.com:443/STM32F405RGT6-STMicroelectronics-datasheet-16486449.pdf?src-supplier=Newark; ComponentLink9URL: https://datasheet.octopart.com:443/STM32F405RGT6-STMicroelectronics-datasheet-14878676.pdf?src-supplier=Farnell; ComponentLink9Description: https://datasheet.octopart.com:443/STM32F405RGT6-STMicroelectronics-datasheet-14878676.pdf?src-supplier=Farnell; ComponentLink10URL: https://datasheet.octopart.com:443/STM32F405RGT6-STMicroelectronics-datasheet-10709433.pdf?src-supplier=Farnell; ComponentLink10Description: https://datasheet.octopart.com:443/STM32F405RGT6-STMicroelectronics-datasheet-10709433.pdf?src-supplier=Farnell; Supplier Part Number 1: STM32F405RGT6
X1 = CRYSTAL 32.768kHz: CRYSTAL 32.768kHz ±20ppm Crystal 12.5pF 90 kOhm -40°C ^ 85°C Surface Mount 2-SMD; Manufacturer: Abracon; ESR (Equivalent Series Resistance): 90kR; Supplier 1: Digikey; Manufacturer Part Number: ABS05-32.768KHZ-T; RoHS: Yes; Category: Crystals; Stock 1: 131313; Pricing 1: 1=0,75, 10=0,628, 50=0,565, 100=0,5022, 500=0,4771, 1000=0,40177 (USD); Mount: Surface Mount; Case/Package: CSMD; Number of Pins: 2; Min Operating Temperature: -40°C; Max Operating Temperature: 85°C; Packaging: Tape and Reel; Frequency Tolerance: 20ppm; Load Capacitance: 12.5pF; Package Quantity: 3000; Tolerance: 20ppm; Termination: SMD/SMT; Series Resistance: 90kR; Series: ABS05; Operating Frequency: 32.768 kHz; Length: 1.6mm; Width: 1mm; Height: 0.5mm; Depth: 1mm; Radiation Hardening: No; Reach SVHC Compliant: No; Lead Free: Lead Free; RoHS Compliant: Yes; ComponentLink1URL: https://datasheet.ciiva.com/23810/abs05-23810480.pdf?src-supplier=Newark; ComponentLink1Description: https://datasheet.ciiva.com/23810/abs05-23810480.pdf?src-supplier=Newark; ComponentLink2URL: https://datasheet.ciiva.com/6728/abs05-6728949.pdf?src-supplier=Digikey; ComponentLink2Description: https://datasheet.ciiva.com/6728/abs05-6728949.pdf?src-supplier=Digikey; ComponentLink3URL: https://datasheet.ciiva.com/6728/abs05-6728950.pdf?src-supplier=Digikey; ComponentLink3Description: https://datasheet.ciiva.com/6728/abs05-6728950.pdf?src-supplier=Digikey; ComponentLink4URL: https://datasheet.ciiva.com/16411/abs05-16411149.pdf?src-supplier=Future+Electronics; ComponentLink4Description: https://datasheet.ciiva.com/16411/abs05-16411149.pdf?src-supplier=Future+Electronics; Supplier Part Number 1: 535-11899-6-ND